# Altium schematic sheet 0022_Processor - CPU ST.SchDoc
size A3
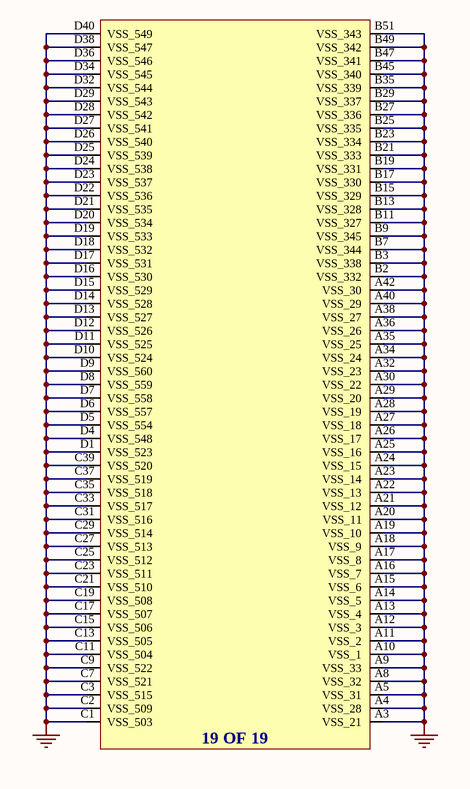
[diagram p0: 0022_Processor - CPU ST.SchDoc]

## Parts
U1401  C_RPL_HX_EXT  (value not drawn)  (part S of 19)

## Nets
GND: U1401.A3(VSS_21) U1401.A4(VSS_28) U1401.A5(VSS_31) U1401.A8(VSS_32) U1401.A9(VSS_33) U1401.A10(VSS_1) U1401.A11(VSS_2) U1401.A12(VSS_3) U1401.A13(VSS_4) U1401.A14(VSS_5) U1401.A15(VSS_6) U1401.A16(VSS_7) U1401.A17(VSS_8) U1401.A18(VSS_9) U1401.A19(VSS_10) U1401.A20(VSS_11) U1401.A21(VSS_12) U1401.A22(VSS_13) U1401.A23(VSS_14) U1401.A24(VSS_15) U1401.A25(VSS_16) U1401.A26(VSS_17) U1401.A27(VSS_18) U1401.A28(VSS_19) U1401.A29(VSS_20) U1401.A30(VSS_22) U1401.A32(VSS_23) U1401.A34(VSS_24) U1401.A35(VSS_25) U1401.A36(VSS_26) U1401.A38(VSS_27) U1401.A40(VSS_29) U1401.A42(VSS_30) U1401.B2(VSS_332) U1401.B3(VSS_338) U1401.B7(VSS_344) U1401.B9(VSS_345) U1401.B11(VSS_327) U1401.B13(VSS_328) U1401.B15(VSS_329) U1401.B17(VSS_330) U1401.B19(VSS_331) U1401.B21(VSS_333) U1401.B23(VSS_334) U1401.B25(VSS_335) U1401.B27(VSS_336) U1401.B29(VSS_337) U1401.B35(VSS_339) U1401.B45(VSS_340) U1401.B47(VSS_341) U1401.B49(VSS_342) U1401.B51(VSS_343) U1401.C1(VSS_503) U1401.C2(VSS_509) U1401.C3(VSS_515) U1401.C7(VSS_521) U1401.C9(VSS_522) U1401.C11(VSS_504) U1401.C13(VSS_505) U1401.C15(VSS_506) U1401.C17(VSS_507) U1401.C19(VSS_508) U1401.C21(VSS_510) U1401.C23(VSS_511) U1401.C25(VSS_512) U1401.C27(VSS_513) U1401.C29(VSS_514) U1401.C31(VSS_516) U1401.C33(VSS_517) U1401.C35(VSS_518) U1401.C37(VSS_519) U1401.C39(VSS_520) U1401.D1(VSS_523) U1401.D4(VSS_548) U1401.D5(VSS_554) U1401.D6(VSS_557) U1401.D7(VSS_558) U1401.D8(VSS_559) U1401.D9(VSS_560) U1401.D10(VSS_524) U1401.D11(VSS_525) U1401.D12(VSS_526) U1401.D13(VSS_527) U1401.D14(VSS_528) U1401.D15(VSS_529) U1401.D16(VSS_530) U1401.D17(VSS_531) U1401.D18(VSS_532) U1401.D19(VSS_533) U1401.D20(VSS_534) U1401.D21(VSS_535) U1401.D22(VSS_536) U1401.D23(VSS_537) U1401.D24(VSS_538) U1401.D25(VSS_539) U1401.D26(VSS_540) U1401.D27(VSS_541) U1401.D28(VSS_542) U1401.D29(VSS_543) U1401.D32(VSS_544) U1401.D34(VSS_545) U1401.D36(VSS_546) U1401.D38(VSS_547) U1401.D40(VSS_549)

## Notes on the sheet
- (in symbol C_RPL_HX_EXT, part S) 19 OF 19